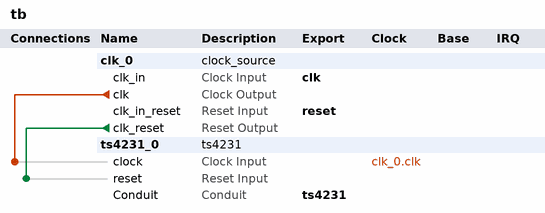
[diagram p0: system contents]
# Platform Designer (Qsys) system tb, Cyclone 10 LP 10CL016YU256C8G
# Parameters at their usual value, and those the tool derives, are not listed.
package require -exact qsys 18.1
create_system tb
set_project_property DEVICE_FAMILY {Cyclone 10 LP}
set_project_property DEVICE 10CL016YU256C8G

add_instance clk_0 clock_source 18.1
set_instance_parameter_value clk_0 clockFrequency 50000000

add_instance ts4231_0 ts4231 1.0
set_instance_parameter_value ts4231_0 CLK_FREQ_HZ 50000000
set_instance_parameter_value ts4231_0 NUMBER_OF_SENSORS 1

# connections
add_connection clk_0.clk ts4231_0.clock clock
add_connection clk_0.clk_reset ts4231_0.reset reset

# exported interfaces
add_interface clk clock sink
set_interface_property clk EXPORT_OF clk_0.clk_in
add_interface reset reset sink
set_interface_property reset EXPORT_OF clk_0.clk_in_reset
add_interface ts4231 conduit end
set_interface_property ts4231 EXPORT_OF ts4231_0.Conduit

set_interconnect_requirement {$system} qsys_mm.clockCrossingAdapter HANDSHAKE
set_interconnect_requirement {$system} qsys_mm.enableEccProtection FALSE
set_interconnect_requirement {$system} qsys_mm.insertDefaultSlave FALSE
set_interconnect_requirement {$system} qsys_mm.maxAdditionalLatency 1

save_system tb.qsys
